# EAGLE design phmeter (EAGLE 7.4.0)
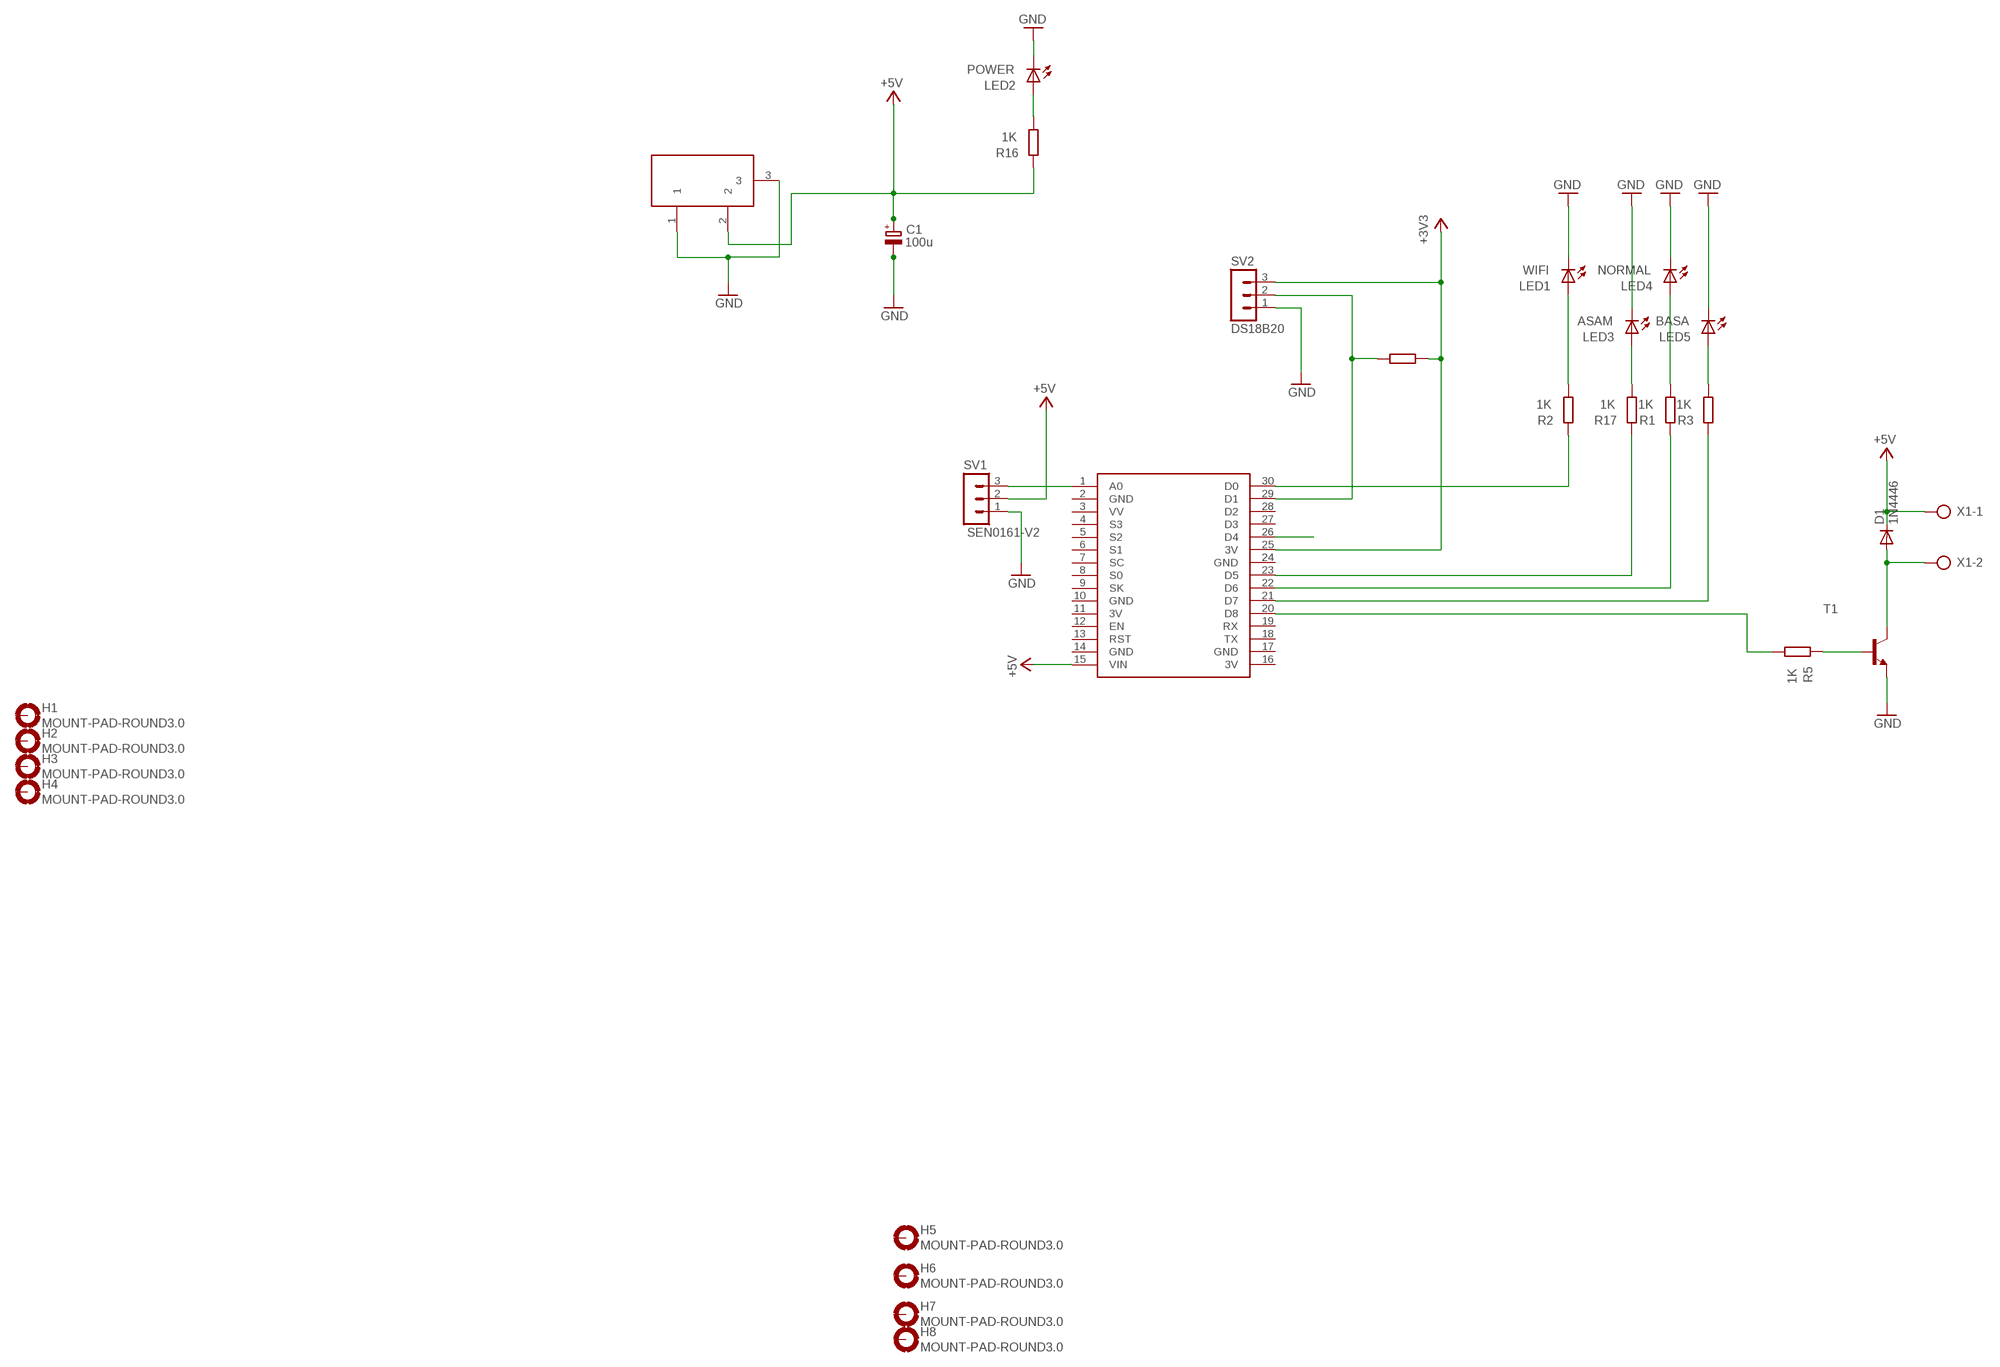
[diagram p0: schematic, sheet 1]

## Parts
C1  100u  CPOL-EUE3.5-8  [E3,5-8]
D1  1N4446  [DO35-10]
DC1  DC21MMX  [DC-21MM]
H1  MOUNT-PAD-ROUND3.0  [3,0-PAD]
H2  MOUNT-PAD-ROUND3.0  [3,0-PAD]
H3  MOUNT-PAD-ROUND3.0  [3,0-PAD]
H4  MOUNT-PAD-ROUND3.0  [3,0-PAD]
H5  MOUNT-PAD-ROUND3.0  [3,0-PAD]
H6  MOUNT-PAD-ROUND3.0  [3,0-PAD]
H7  MOUNT-PAD-ROUND3.0  [3,0-PAD]
H8  MOUNT-PAD-ROUND3.0  [3,0-PAD]
LED1  WIFI  LED5MM  [LED5MM]
LED2  POWER  LED5MM  [LED5MM]
LED3  ASAM  LED5MM  [LED5MM]
LED4  NORMAL  LED5MM  [LED5MM]
LED5  BASA  LED5MM  [LED5MM]
R1  1K  R-EU_0207/10  [0207/10]
R2  1K  R-EU_0207/10  [0207/10]
R3  1K  R-EU_0207/10  [0207/10]
R4  1k  R-EU_0207/10  [0207/10]
R5  1K  R-EU_0207/10  [0207/10]
R16  1K  R-EU_0207/10  [0207/10]
R17  1K  R-EU_0207/10  [0207/10]
SV1  SEN0161-V2  MA03-1  [MA03-1]
SV2  DS18B20  MA03-1  [MA03-1]
T1  BC337-NPN-TO92-CBE  [TO92-CBE]
U$1  NODEMCU  [NODEMCU]
X1  AK300/2  [AK300/2]

## Nets
+3V3: R4.1 SV2.3 U$1.25(3V)
+5V [power]: C1.+ D1.C DC1.2 R16.2 SV1.2 U$1.15(VIN) X1.1
GND: C1.- DC1.1 DC1.3 LED1.K(C) LED2.K(C) LED3.K(C) LED4.K(C) LED5.K(C) SV1.1 SV2.1 T1.E
N$1: U$1.26(D4)
N$2: LED4.A R1.1
N$3: LED5.A R3.1
N$4: R1.2 U$1.22(D6)
N$5: R3.2 U$1.21(D7)
N$6: SV1.3 U$1.1(A0)
N$7: D1.A T1.C X1.2
N$8: R5.2 T1.B
N$9: R5.1 U$1.20(D8)
N$11: R4.2 SV2.2 U$1.29(D1)
N$12: R2.2 U$1.30(D0)
N$13: R17.2 U$1.23(D5)
N$19: LED2.A R16.1
N$21: LED3.A R17.1
N$32: LED1.A R2.1
Unconnected: H1.B3,0(MOUNT) H2.B3,0(MOUNT) H3.B3,0(MOUNT) H4.B3,0(MOUNT) H5.B3,0(MOUNT) H6.B3,0(MOUNT) H7.B3,0(MOUNT) H8.B3,0(MOUNT) U$1.3(VV) U$1.4(S3) U$1.5(S2) U$1.6(S1) U$1.7(SC) U$1.8(S0) U$1.9(SK) U$1.12(EN) U$1.13(RST) U$1.18(TX) U$1.19(RX) U$1.27(D3) U$1.28(D2)

## Power pins joined to a net without a drawn wire
3V: U$1.11(3V) U$1.16(3V)
GND: U$1.2(GND) U$1.10(GND) U$1.14(GND) U$1.17(GND) U$1.24(GND)

## Library data of the parts
C1 = rcl:CPOL-EU: POLARIZED CAPACITOR, European symbol
D1 = diode:1N4446: DIODE high speed (Philips)
DC1 = powersupply:DC21MM
H1-H8 = holes:MOUNT-PAD-ROUND: MOUNTING PAD, round
LED1-LED5 = led:LED: LED OSRAM: - CHIPLED LG R971, LG N971, LY N971, LG Q971, LY Q971, LO R971, LY R971 LH N974, LH R974 LS Q976, LO Q976, LY Q976 LO Q996 - Hyper CHIPLED LW Q18S LB Q993, LB Q99A, LB R99A - SideLED LS A670, LO A670, LY A670, LG A670, LP A670 LB A673, LV A673, LT A673, LW A673 LH A674 LY A675 LS A676, LA A676, LO A676, LY A676, LW A676 LS A679, LY A679, LG A679 - Hyper Micro SIDELED® LS Y876, LA Y876, LO Y876, LY Y876 LT Y87S - SmartLED LW L88C, LW L88S LB L89C, LB L89S, LG L890 LS L89K, LO L89K, LY L89K LS L896, LA L896, LO L896, LY L896 - TOPLED LS T670, LO T670, LY T670, LG T670, LP T670 LSG T670, LSP T670, LSY T670, LOP T670, LYG T670 LG T671, LOG T671, LSG T671 LB T673, LV T673, LT T673, LW T673 LH T674 LS T676, LA T676, LO T676, LY T676, LB T676, LH T676, LSB T676, LW T676 LB T67C, LV T67C, LT T67C, LS T67K, LO T67K, LY T67K, LW E67C LS E67B, LA E67B, LO E67B, LY E67B, LB E67C, LV E67C, LT E67C LW T67C LS T679, LY T679, LG T679 LS T770, LO T770, LY T770, LG T770, LP T770 LB T773, LV T773, LT T773, LW T773 LH T774 LS E675, LA E675, LY E675, LS T675 LS T776, LA T776, LO T776, LY T776, LB T776 LHGB T686 LT T68C, LB T68C - Hyper Mini TOPLED® LB M676 - Mini TOPLED Santana® LG M470 LS M47K, LO M47K, LY M47K Source: http://www.osram.convergy.de LUXEON: - LUMILED® LXK2-PW12-R00, LXK2-PW12-S00, LXK2-PW14-U00, LXK2-PW14-V00 LXK2-PM12-R00, LXK2-PM12-S00, LXK2-PM14-U00 LXK2-PE12-Q00, LXK2-PE12-R00, LXK2-PE12-S00, LXK2-PE14-T00, LXK2-PE14-U00 LXK2-PB12-K00, LXK2-PB12-L00, LXK2-PB12-M00, LXK2-PB14-N00, LXK2-PB14-P00, LXK2-PB14-Q00 LXK2-PR12-L00, LXK2-PR12-M00, LXK2-PR14-Q00, LXK2-PR14-R00 LXK2-PD12-Q00, LXK2-PD12-R00, LXK2-PD12-S00 LXK2-PH12-R00, LXK2-PH12-S00 LXK2-PL12-P00, LXK2-PL12-Q00, LXK2-PL12-R00 Source: www.luxeon.com KINGBRIGHT: KA-3528ASYC Source: www.kingbright.com
R1-R5 R16 R17 = rcl:R-EU_: RESISTOR, European symbol
SV1 SV2 = con-lstb:MA03-1: PIN HEADER; OC_FARNELL: unknown; OC_NEWARK: unknown
T1 = transistor:*-NPN-: NPN Transistror BF959 corrected 2008.03.06
U$1 = nodemcu:NODEMCU
X1 = con-ptr500:AK300/2: CONNECTOR; OC_FARNELL: unknown; OC_NEWARK: unknown

## Net classes
1 power: width 0.61 mm

## Board
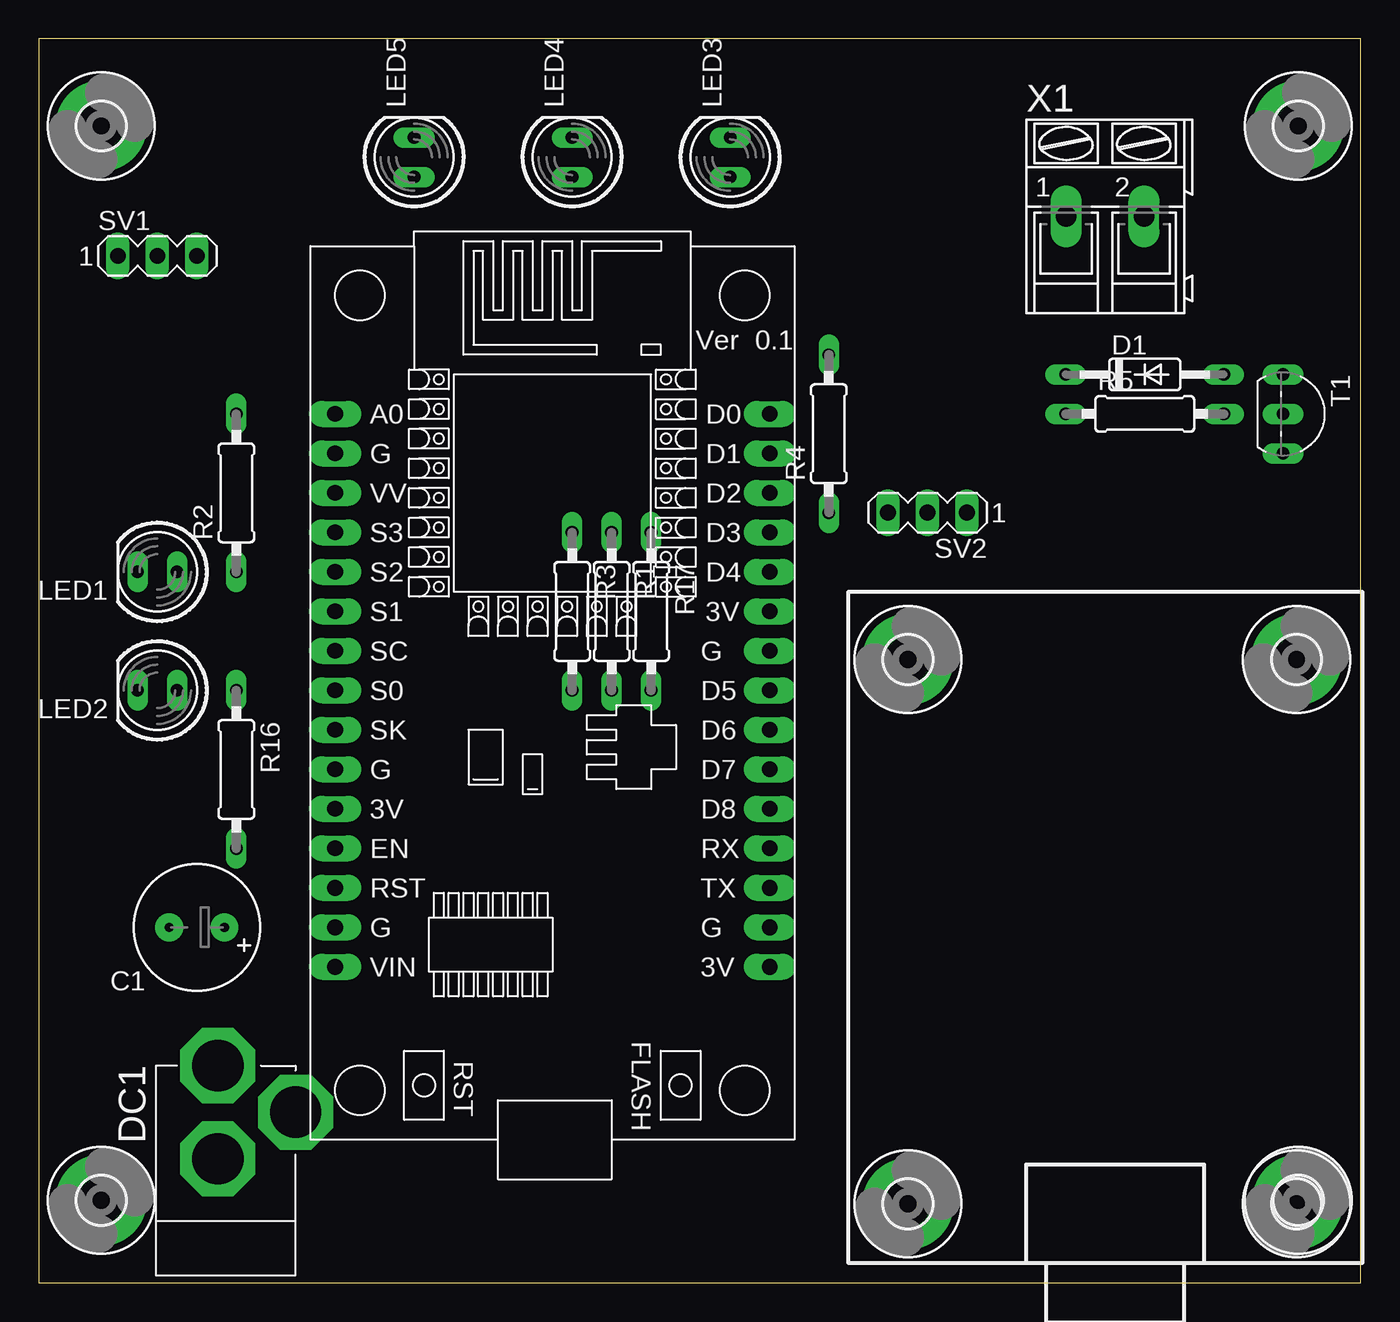
[diagram p1: board, top side]
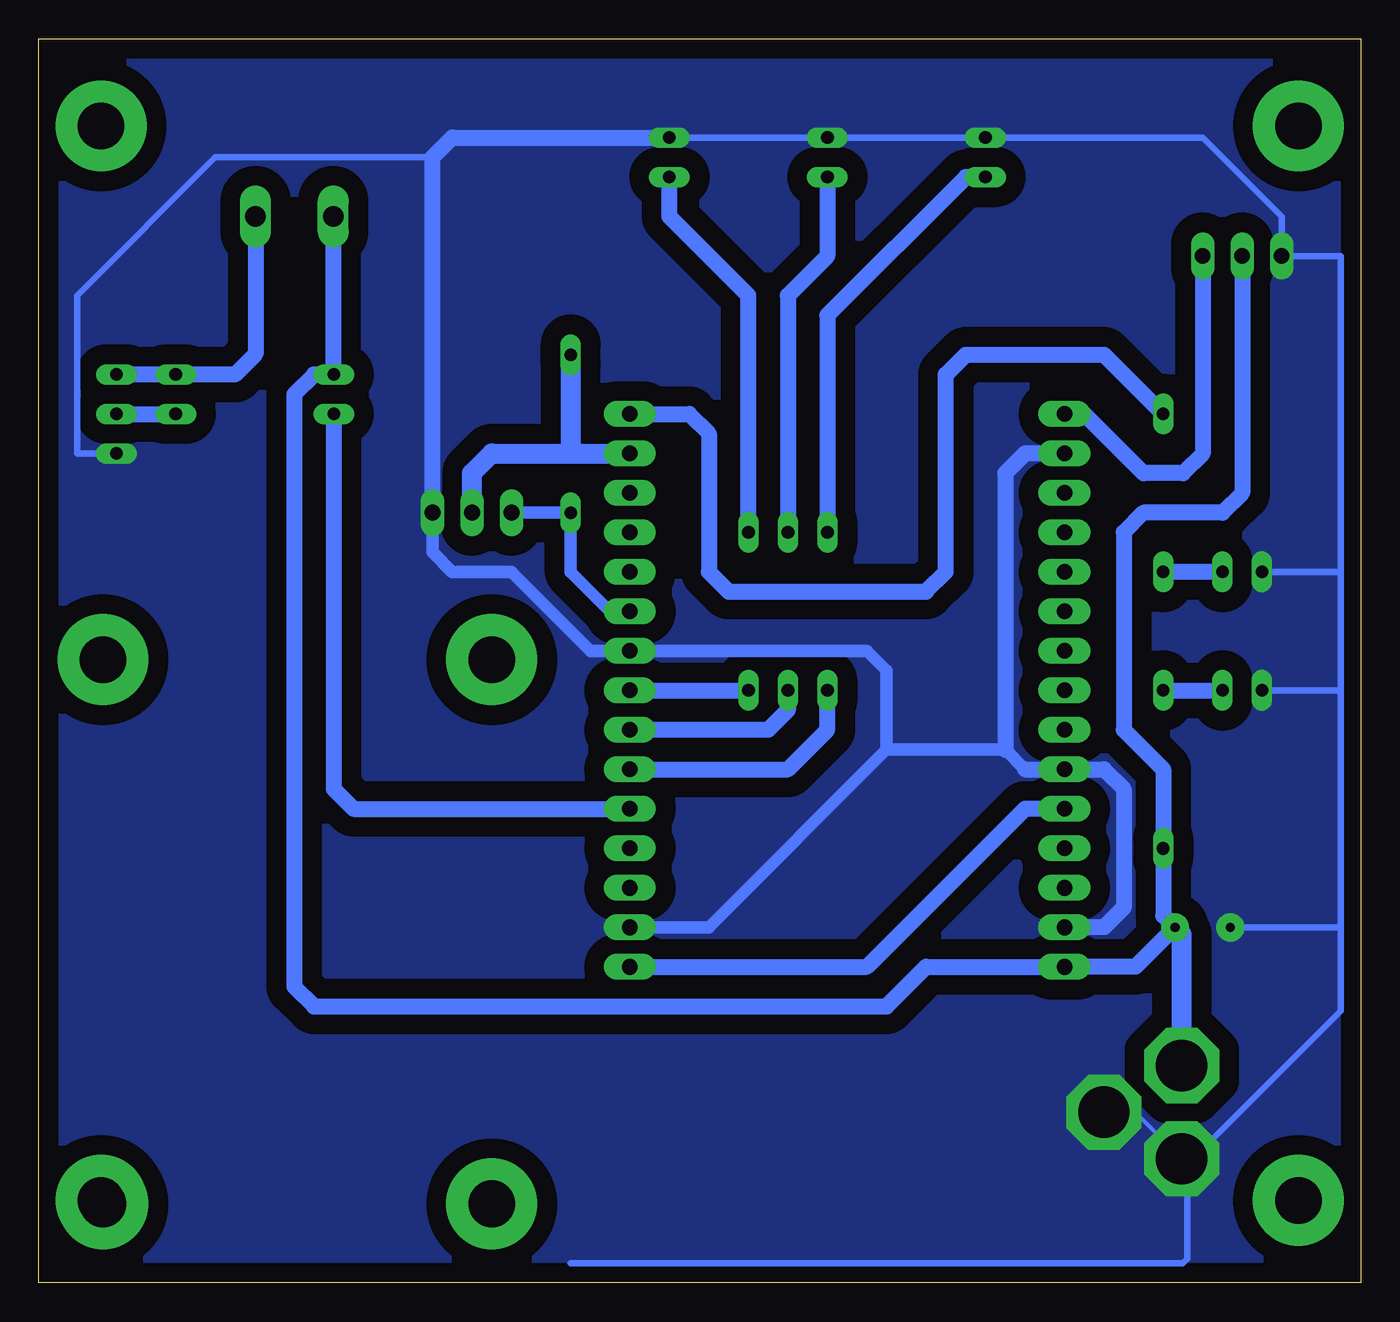
[diagram p2: board, bottom side, seen from below]

Size 85 x 80 mm. Coordinates in mm from the lower left corner, seen from the top.
Outline: 0,0 85,0 85,80 0,80 0,0
Copper layers (1*16): Top 0.035mm / dielectric 1.5mm / Bottom 0.035mm
Design rules "default": minimum track width 10mil, minimum drill 24mil, track to track 8mil, track to pad 8mil, pad to pad 8mil, via to via 8mil, smd to smd 8mil, copper to edge 40mil, drill to drill 8mil, minimum pad ring 10mil, minimum via ring 8mil, stop-mask expansion 4mil, vias tented up to drill 0mil, thermal gap 10mil

### Footprints (pad centres in the part's own frame; a part is rotated, then mirrored left to right if it is on the bottom)
E3,5-8 = drill 0.6 pad 1.778: + -1.778,0; - 1.778,0
DO35-10 = drill 0.813 long: A 5.08,0; C -5.08,0
DC-21MM = drill 3.302 pad 4.826 octagon: 1 -5.08,-3.353; 2 -0.076,-6.35; 3 -0.076,-0.356
3,0-PAD = drill 3 pad 5.842: B3,0 0,0
LED5MM = drill 0.813 long: A -1.27,0; K 1.27,0
0207/10 = drill 0.813 long: 1 -5.08,0; 2 5.08,0
MA03-1 = drill 1.016 long: 1 -2.54,0; 2 0,0; 3 2.54,0
TO92-CBE = drill 0.813 long: B 0,0; C -2.54,0; E 2.54,0
NODEMCU = drill 1 pad 1.676 long: 1 -13.97,17.78; 2 -13.97,15.24; 3 -13.97,12.7; 4 -13.97,10.16; 5 -13.97,7.62; 6 -13.97,5.08; 7 -13.97,2.54; 8 -13.97,0; 9 -13.97,-2.54; 10 -13.97,-5.08; 11 -13.97,-7.62; 12 -13.97,-10.16; 13 -13.97,-12.7; 14 -13.97,-15.24; 15 -13.97,-17.78; 16 13.97,-17.78; 17 13.97,-15.24; 18 13.97,-12.7; 19 13.97,-10.16; 20 13.97,-7.62; 21 13.97,-5.08; 22 13.97,-2.54; 23 13.97,0; 24 13.97,2.54; 25 13.97,5.08; 26 13.97,7.62; 27 13.97,10.16; 28 13.97,12.7; 29 13.97,15.24; 30 13.97,17.78
AK300/2 = drill 1.321 long: 1 -2.515,0; 2 2.489,0

### Placement (x,y rotation side)
C1  10.16,22.86 180 top
D1  71.12,58.42 0 top
DC1  11.43,7.62 180 top
H1  81,5.3 0 top
H2  81,74.4 0 top
H3  4,74.4 0 top
H4  4,5.3 0 top
H5  80.88,40.08 0 top
H6  55.88,40.08 0 top
H7  80.88,5.08 0 top
H8  55.88,5.08 0 top
LED1  7.62,45.72 180 top
LED2  7.62,38.1 180 top
LED3  44.45,72.39 90 top
LED4  34.29,72.39 90 top
LED5  24.13,72.39 90 top
R1  36.83,43.18 270 top
R2  12.7,50.8 90 top
R3  34.29,43.18 270 top
R4  50.8,54.61 90 top
R5  71.12,55.88 0 top
R16  12.7,33.02 270 top
R17  39.37,43.18 270 top
SV1  7.62,66.04 0 top
SV2  57.15,49.53 180 top
T1  80.01,55.88 270 top
U$1  33.02,38.1 0 top
X1  68.58,68.58 0 top

### Tracks (layer width: path | path; a pad name or v marks a point on that pad's centre or on a via)
3V
  Bottom 1.016: U$1.11 21.59,30.48 31.75,20.32 U$1.16
+3V3
  Bottom 0.813: SV2.3 R4.1 50.8,45.72 48.26,43.18 U$1.25
+5V
  Bottom 1.016: SV1.2 7.62,50.8 8.89,49.53 13.97,49.53 15.24,48.26 15.24,35.56 12.7,33.02 R16.2 12.7,23.62 C1.+ 14.48,20.32 U$1.15 27.94,20.32 30.48,17.78 67.31,17.78 68.58,19.05 68.58,57.15 67.31,58.42 D1.C 66.06,58.44 X1.1
  Bottom 1.27: DC1.2 11.51,22.43 C1.+
GND
  Bottom 0.254: 11.15,7.62 DC1.3 14.5,10.97 DC1.1
  Bottom 0.406: C1.- 1.27,22.86 | LED2.K 1.27,38.1 | 1.27,38.1 1.27,22.86 | LED1.K 1.27,45.72 | 1.27,45.72 1.27,38.1 | LED3.K LED4.K LED5.K 10.16,73.66 5.08,68.58 SV1.1 1.27,66.04 1.27,45.72 | 50.8,1.27 11.43,1.27 11.15,1.55 11.15,7.62 1.27,17.5 1.27,22.86 | T1.E 82.55,53.34 82.55,63.5 73.66,72.39 59.69,72.39
  Bottom 0.813: SV2.1 59.69,46.99 58.42,45.72 54.61,45.72 49.53,40.64 U$1.24 31.75,40.64 30.48,39.37 30.48,34.29 | U$1.17 41.91,22.86 30.48,34.29 | 30.48,34.29 22.86,34.29 21.59,33.02
  Bottom 1.016: U$1.2 21.59,53.34 22.86,52.07 22.86,34.29 | 21.59,33.02 U$1.10 16.51,33.02 15.24,31.75 15.24,24.13 16.51,22.86 U$1.14 | SV2.1 59.69,72.39 58.42,73.66 LED3.K
  pour Bottom (isolate 1.27, no thermals): -1.27,-1.27 -1.27,81.28 86.36,81.28 87.63,-1.27
N$2
  Bottom 1.016: LED4.A 34.29,66.04 36.83,63.5 R1.1
N$3
  Bottom 1.016: LED5.A 25.4,71.12 34.29,62.23 R3.1
N$4
  Bottom 1.016: R1.2 36.83,36.83 38.1,35.56 U$1.22
N$5
  Bottom 1.016: U$1.21 36.83,33.02 34.29,35.56 R3.2
N$6
  Bottom 1.016: SV1.3 10.16,53.34 11.43,52.07 13.97,52.07 17.78,55.88 U$1.1
N$7
  Bottom 1.016: X1.2 71.07,59.74 72.39,58.42 D1.A T1.C
N$8
  Bottom 1.016: T1.B R5.2
N$9
  Bottom 1.016: R5.1 66.04,31.75 64.77,30.48 U$1.20
N$11
  Bottom 1.27: SV2.2 57.15,52.07 55.88,53.34 50.8,53.34 | 50.8,53.34 U$1.29 | R4.2 50.8,53.34
N$12
  Bottom 1.016: U$1.30 43.18,55.88 41.91,54.61 41.91,45.72 40.64,44.45 27.94,44.45 26.67,45.72 26.67,58.42 25.4,59.69 16.51,59.69 R2.2
N$13
  Bottom 1.016: U$1.23 R17.2
N$19
  Bottom 1.016: R16.1 LED2.A
N$21
  Bottom 1.016: R17.1 39.37,63.5 44.45,68.58 LED3.A
N$32
  Bottom 1.016: LED1.A R2.1